# Altium schematic sheet Ext counter.SchDoc: Ext counter
size A4; SheetNumber: 1; SheetTotal: 1; PartNumber: Part of; Drawn By: Sebastian Kulik; ProjectName: DVT SPI buffer
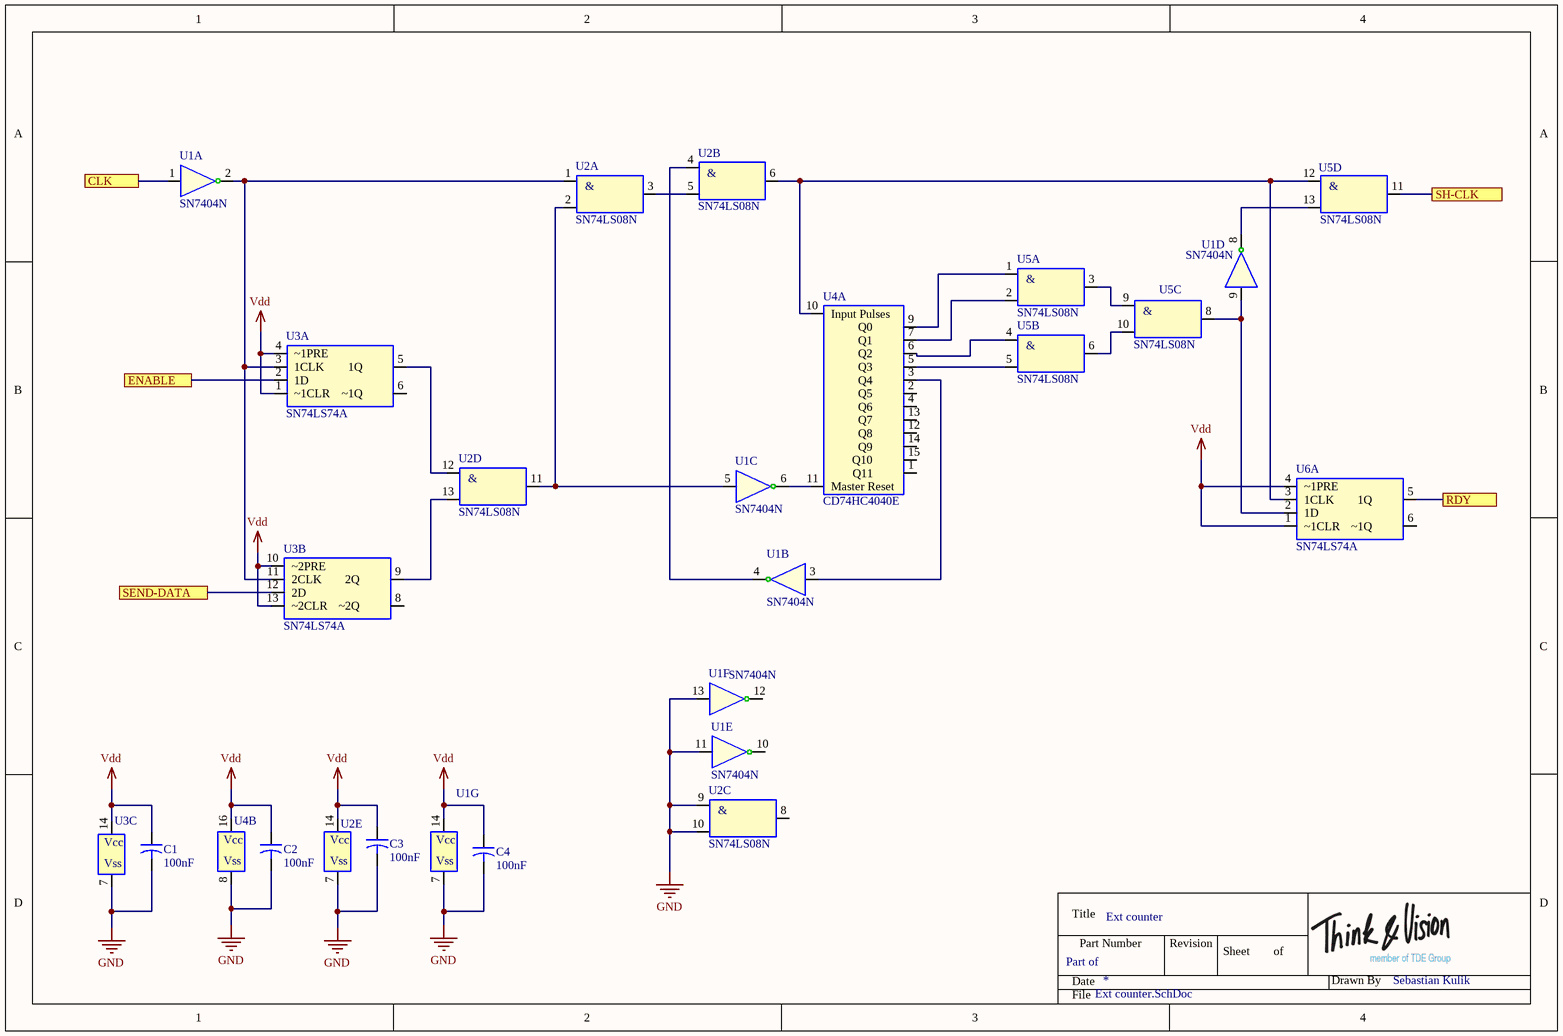
[diagram p0: Ext counter.SchDoc]

## Parts
C1  value 100nF  [Dummy-10mm]  (hidden comment: Capacitor-Dummy-THT)
C2  value 100nF  [Dummy-10mm]  (hidden comment: Capacitor-Dummy-THT)
C3  value 100nF  [Dummy-10mm]  (hidden comment: Capacitor-Dummy-THT)
C4  value 100nF  [Dummy-10mm]  (hidden comment: Capacitor-Dummy-THT)
U1  SN7404N  [DIP-14]  (parts A,B,C,D,E,F,G of 7)
U2  SN74LS08N  [DIP-14]  (parts A,B,C,D,E of 5)
U3  SN74LS74A  [DIP-14]  (parts A,B,C of 3)
U4  CD74HC4040E  [DIP-16]  (parts A,B of 2)
U5  SN74LS08N  [DIP-14]  (parts A,B,C,D of 5)
U6  SN74LS74A  [DIP-14]  (part A of 3)

## Ports
CLK, ENABLE, RDY, SEND-DATA, SH-CLK

## Nets
GND: C1.2 C2.2 C3.2 C4.2 U1.7(Vss) U1.11(5A) U1.13(6A) U2.7(Vss) U2.9(3A) U2.10(3B) U3.7(Vss) U4.8(Vss)
Vdd: C1.1 C2.1 C3.1 C4.1 U1.14(Vcc) U2.14(Vcc) U3.1(~1CLR) U3.4(~1PRE) U3.10(~2PRE) U3.13(~2CLR) U3.14(Vcc) U4.16(Vcc) U6.1(~1CLR) U6.4(~1PRE)
CLK: U1.1(1A) ; port CLK
ENABLE: U3.2(1D) ; port ENABLE
RDY: U6.5(1Q) ; port RDY
SEND-DATA: U3.12(2D) ; port SEND-DATA
SH-CLK: U5.11(Y4) ; port SH-CLK
NetU1_2: U1.2(1Y) U2.1(1A) U3.3(1CLK) U3.11(2CLK)
NetU1_3: U1.3(2A) U4.3(Q4)
NetU1_4: U1.4(2Y) U2.4(2A)
NetU1_5: U1.5(3A) U2.2(1B) U2.11(Y4)
NetU1_6: U1.6(3Y) U4.11(Master_Reset)
NetU1_8: U1.8(Y4) U5.13(4B)
NetU1_9: U1.9(4A) U5.8(Y3) U6.2(1D)
NetU2_3: U2.3(Y1) U2.5(2B)
NetU2_6: U2.6(Y2) U4.10(Input_Pulses) U5.12(4A) U6.3(1CLK)
NetU2_12: U2.12(4A) U3.5(1Q)
NetU2_13: U2.13(4B) U3.9(2Q)
NetU4_5: U4.5(Q3) U5.5(2B)
NetU4_6: U4.6(Q2) U5.4(2A)
NetU4_7: U4.7(Q1) U5.2(1B)
NetU4_9: U4.9(Q0) U5.1(1A)
NetU5_3: U5.3(Y1) U5.9(3A)
NetU5_6: U5.6(Y2) U5.10(3B)

Not connected (* = marked no-connect by the designer): U1 10(5Y) 12(6Y); U2 8(Y3); U3 6(~1Q) 8(~2Q); U4 1(Q11) 2(Q5) 4(Q6) 12(Q8) 13(Q7) 14(Q9) 15(Q10); U6 6(~1Q)

## Notes on the sheet
- Title
- Date
- Part Number
- Revision
- Sheet
- of
- Drawn By
- File
- (in symbol SN74LS08N, part A) &
- (in symbol SN74LS08N, part B) &
- (in symbol SN74LS08N, part C) &
- (in symbol SN74LS08N, part D) &

## Library data of the parts
C1-C4 = Capacitor-Dummy-THT: Deliverer PartNr: 721-5240; Deliverer: RS; Published: 08.12.2015; Part Description: Capacitor-Dummy-THT; Publisher: Sebastian Kulik; PackageDescription: -; Manufacturer: -; Manufacturer PartNr: -; TDE-PN: -; Price: 0.081/50
U1 = SN7404N: Hex Inverter TTL; Deliverer PartNr: 305-529; Manufacturer: TI; Deliverer: RS; TDE-PN: IC0086; Published: 24.11.2016; PackageDescription: DIP14; Publisher: Sebastian Kulik; Manufacturer PartNr: SN7404N; Price: 1
U2 U5 = SN74LS08N: Quad AND, TTL; Deliverer PartNr: 307-519; Manufacturer: TI; Deliverer: RS; TDE-PN: IC0088; Published: 24.11.2016; PackageDescription: DIP14; Publisher: Sebastian Kulik; Manufacturer PartNr: SN74LS08N; Price: 0.56
U3 U6 = SN74LS74A: Flip-Flop Dual, TTL; Deliverer PartNr: 307-597; Manufacturer PartNr: SN74LS74AN; Manufacturer: TI; Deliverer: RS; TDE-PN: IC0089; Published: 24.11.2016; PackageDescription: DIP14; Publisher: Sebastian Kulik; Price: 0.48
U4 = CD74HC4040E: High Speed CMOS Logic 12-Stage Binary Counter; Deliverer PartNr: 807-2457; Manufacturer: TI; Deliverer: RS; TDE-PN: IC0090; Published: 09.12.2016; PackageDescription: DIP16; Publisher: Sebastian Kulik; Manufacturer PartNr: CD74HC4040E; Price: 0.464/25